# EAGLE design hotswap (EAGLE 9.3.0)
TEAM: IGVC
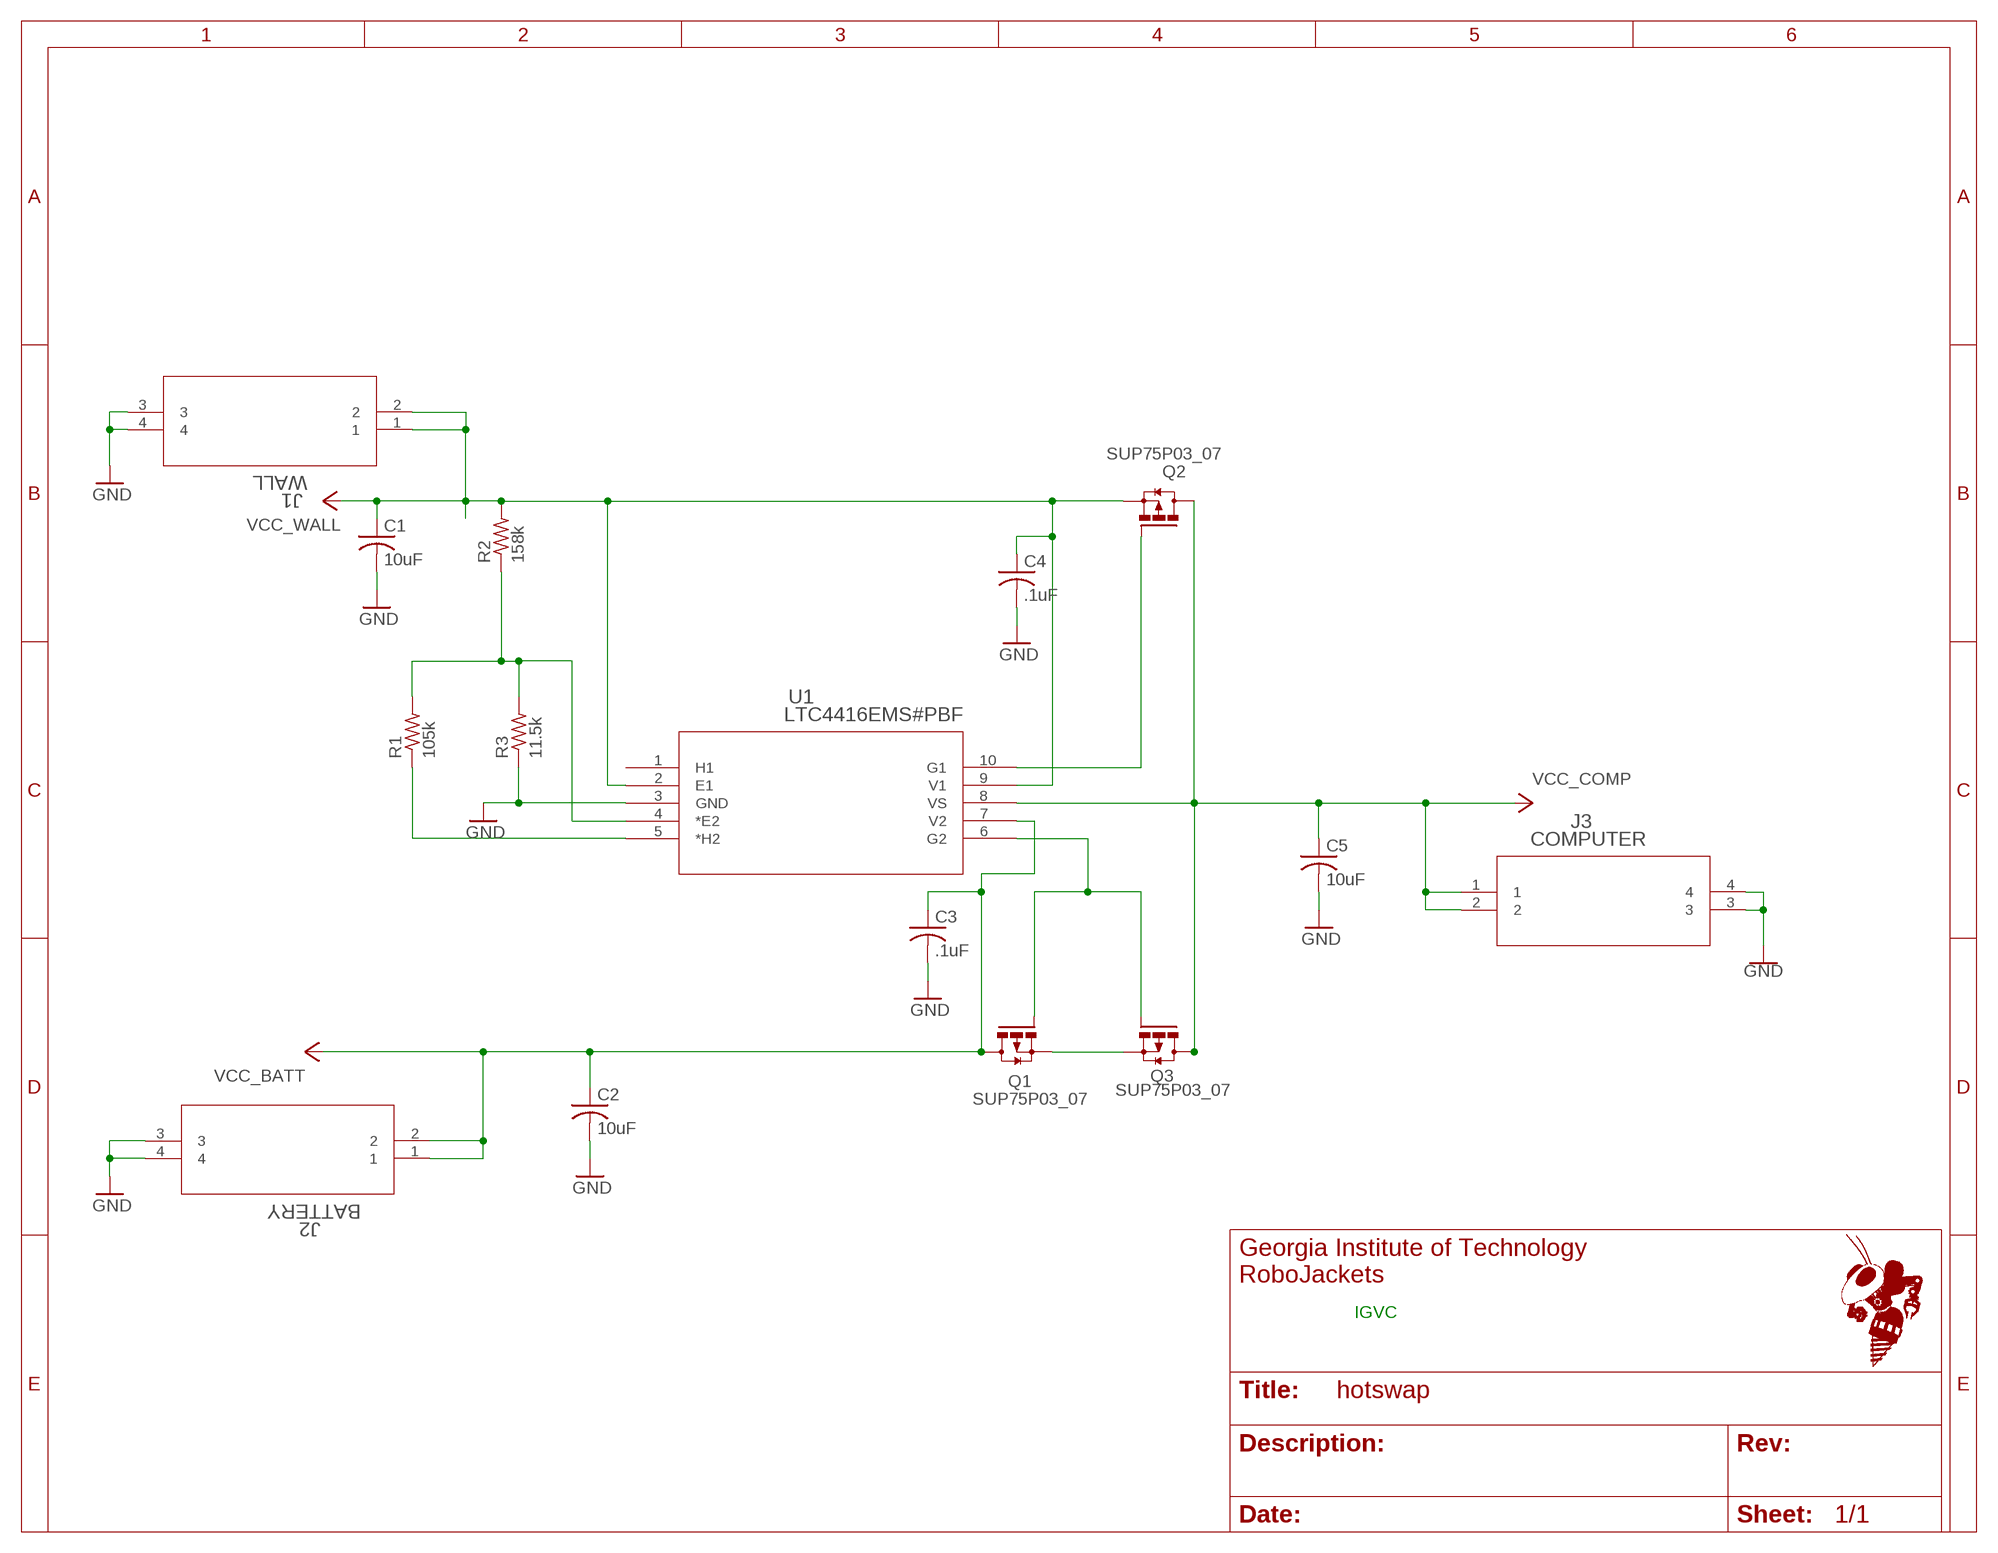
[diagram p0: schematic, sheet 1]

## Parts
C1  10uF  C-USC1210  [C1210]
C2  10uF  C-USC1210  [C1210]
C3  .1uF  C-USC0805  [C0805]
C4  .1uF  C-USC0805  [C0805]
C5  10uF  C-USC1210  [C1210]
J1  WALL  641737-1  [641737-1]
J2  BATTERY  641737-1  [641737-1]
J3  COMPUTER  641737-1  [641737-1]
Q1  SUP75P03_07  [DPACK_2]
Q2  SUP75P03_07  [DPACK_2]
Q3  SUP75P03_07  [DPACK_2]
R1  105k  R-US_R0603  [R0603]
R2  158k  R-US_R0603  [R0603]
R3  11.5k  R-US_R0603  [R0603]
U1  LTC4416EMS#PBF  [MSOP-10_MS]

## Nets
GND: C1.2 C2.2 C3.2 C4.2 C5.2 J1.3 J1.4 J2.3 J2.4 J3.3 J3.4 R3.1 U1.3(GND)
N$1: Q1.S Q3.S
N$3: Q1.G Q3.G U1.6(G2)
N$4: Q2.G U1.10(G1)
N$5: R1.2 R2.1 R3.2 U1.4(*E2)
N$9: R1.1 U1.5(*H2)
VCC_BATT: C2.1 C3.1 J2.1 J2.2 Q1.D U1.7(V2)
VCC_COMP: C5.1 J3.1 J3.2 Q2.D Q3.D U1.8(VS)
VCC_WALL: C1.1 C4.1 J1.1 J1.2 Q2.S R2.2 U1.2(E1) U1.9(V1)
Unconnected: U1.1(H1)

## Notes on the sheet
- IGVC

## Library data of the parts
C1-C5 = rcl:C-US: CAPACITOR, American symbol; SPICEPREFIX: C
J1-J3 = IGVC-Connector:641737-1; MANUFACTURER_PART_NUMBER: 6417371; VENDOR: TE Connectivity
Q1-Q3 = IGVC-Discrete:SUP75P03_07
R1-R3 = rcl:R-US_: RESISTOR, American symbol; SPICEPREFIX: R
U1 = IGVC-Discrete:LTC4416EMS#PBF; DESCRIPTION: LTC4416/LTC4416-1 - 36V, Low Loss Dual PowerPath Controllers for Large PFETs; DIGI-KEY_PART_NUMBER: LTC4416EMS#PBF-ND; DIGI-KEY_PURCHASE_URL: https://www.digikey.com/product-detail/en/linear-technology-analog-devices/LTC4416EMS-PBF/LTC4416EMS-PBF-ND/1620181?utm_source=snapeda&utm_medium=aggregator&utm_campaign=symbol; MF: Linear Technology; MP: LTC4416EMS#PBF; PACKAGE: MSOP-10 Linear Technology

## Board
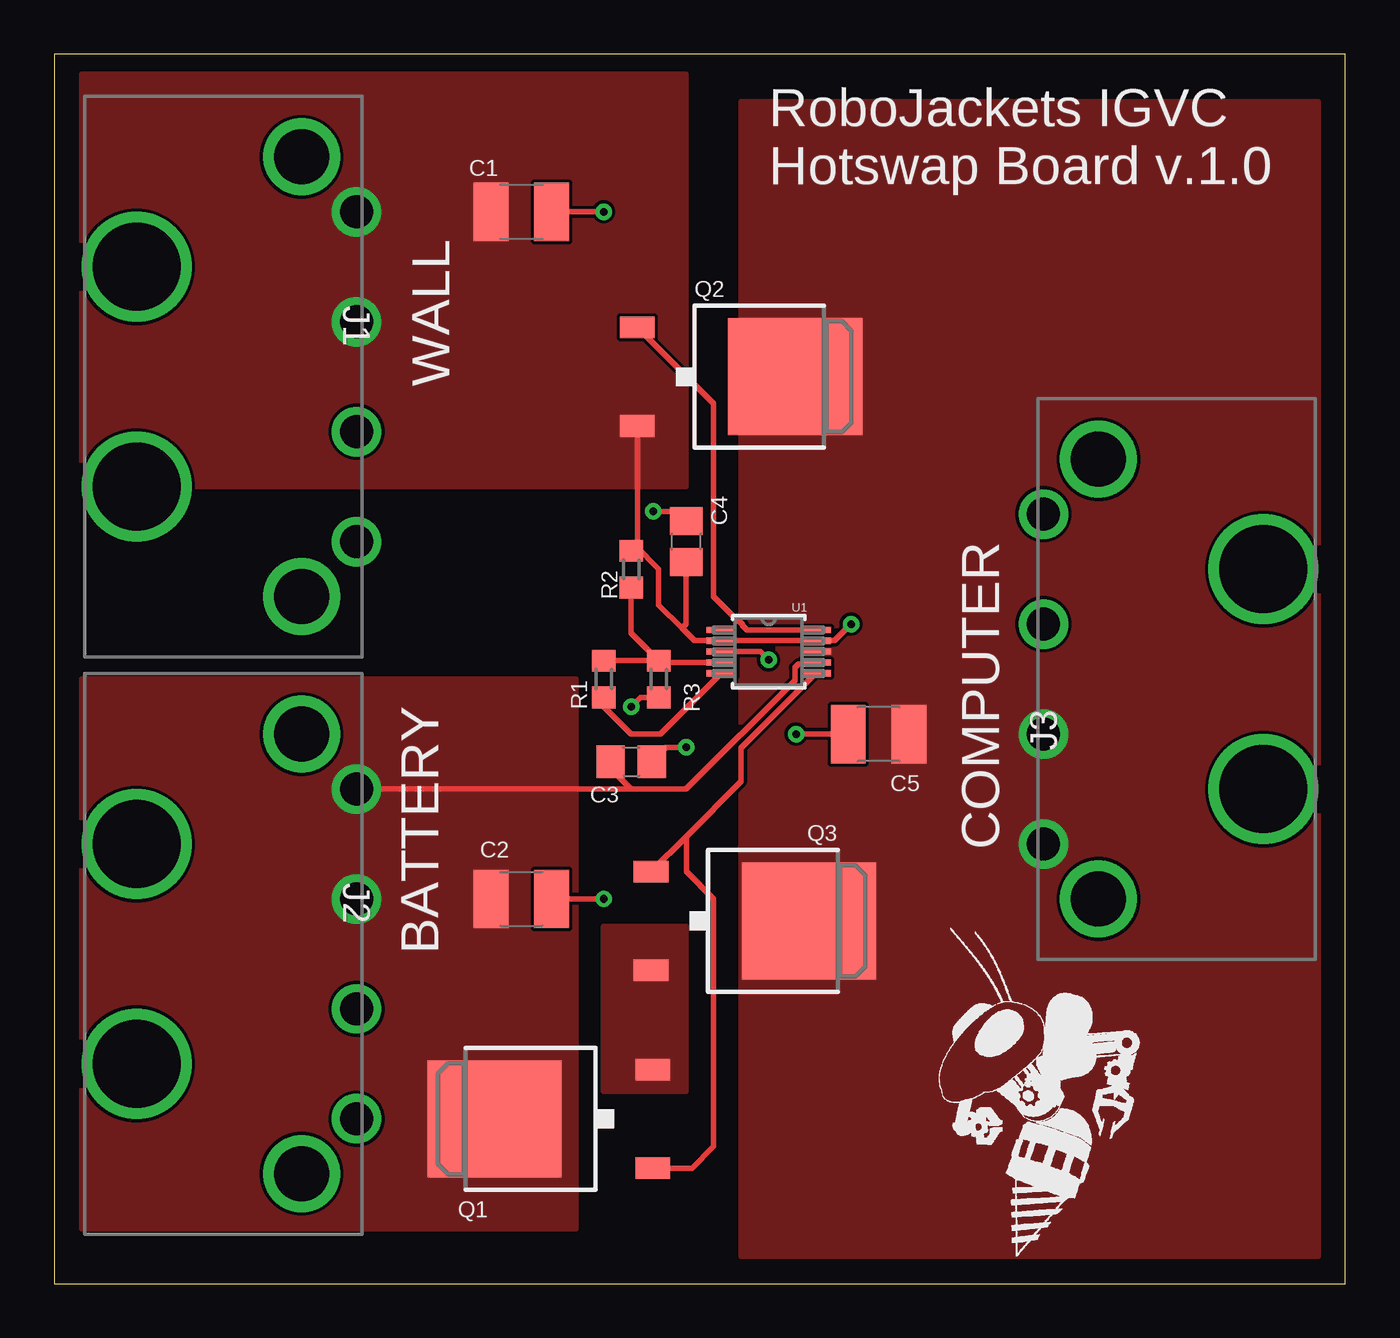
[diagram p1: board, top side]
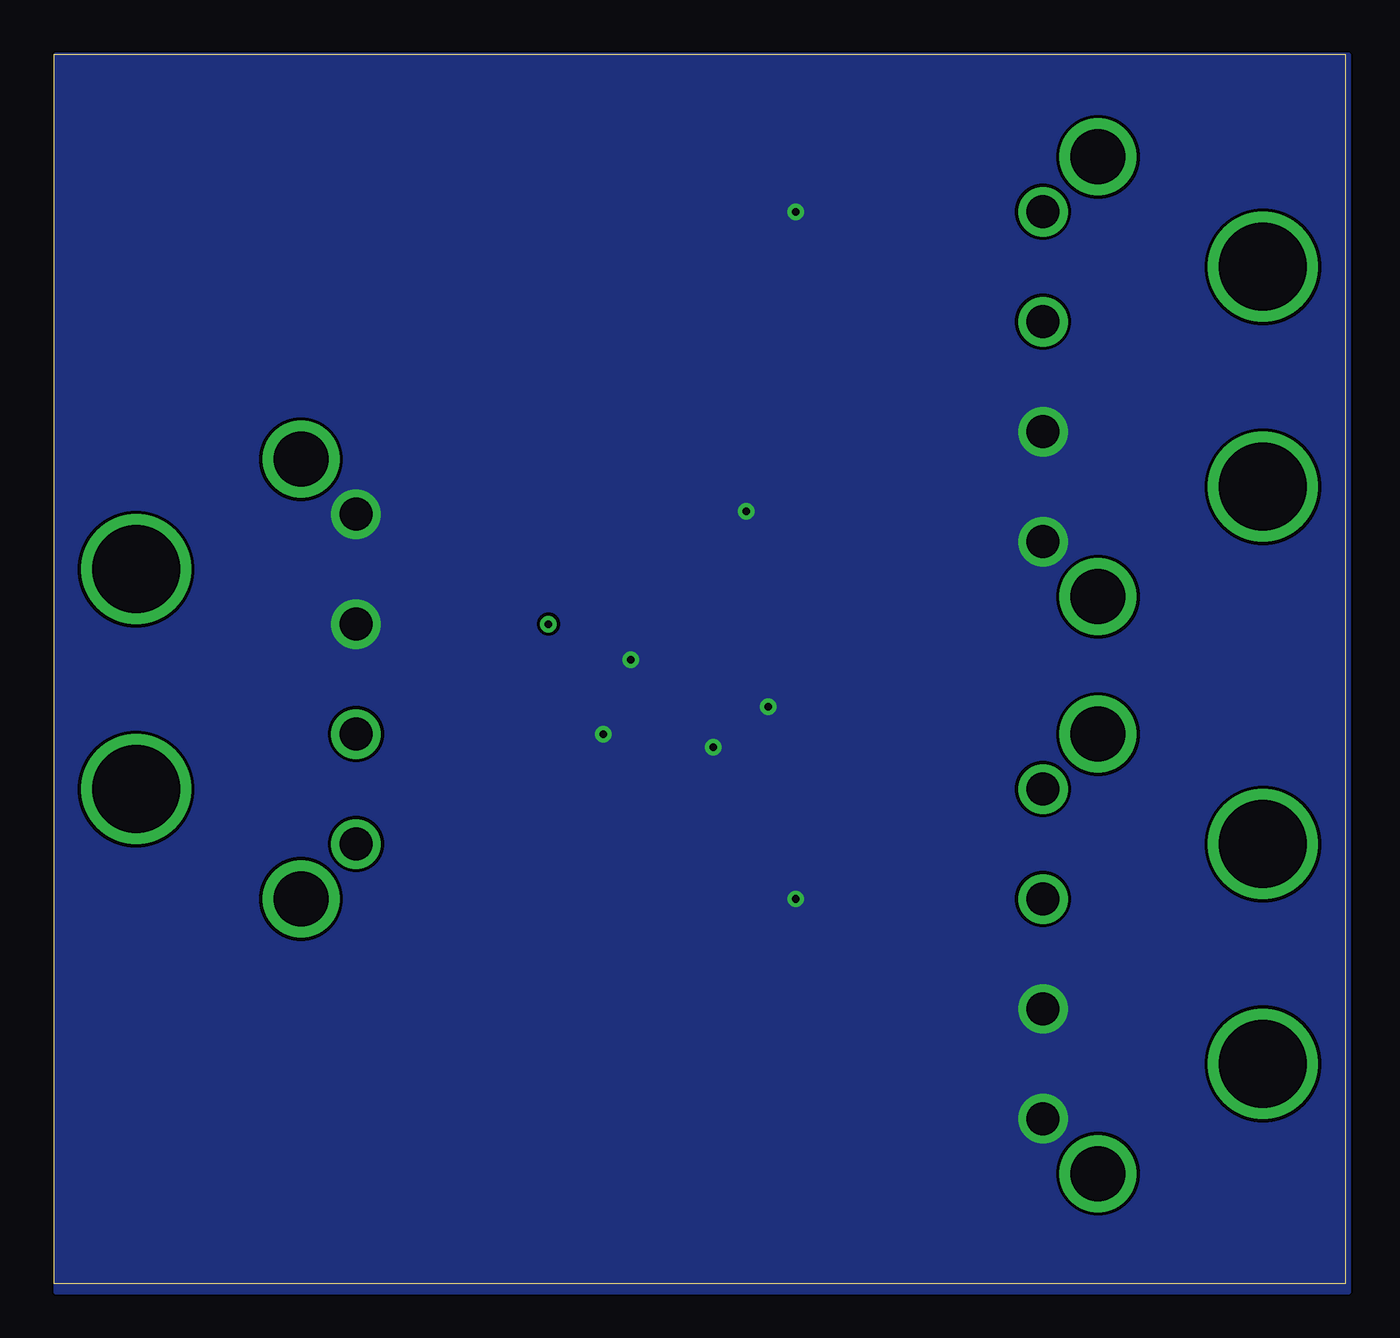
[diagram p2: board, bottom side, seen from below]

Size 59.67 x 56.82 mm. Coordinates in mm from the lower left corner, seen from the top.
Outline: 0,0 59.67,0 59.67,56.82 0,56.82 0,0
Copper layers (1*16): Top 0.0356mm / dielectric 63mil / Bottom 0.0356mm
Design rules "RJ2LayerDRU *": minimum track width 6mil, minimum drill 15mil, track to track 6mil, track to pad 6mil, pad to pad 6mil, via to via 6mil, smd to smd 6mil, copper to edge 0mil, drill to drill 6mil, minimum pad ring 10mil, minimum via ring 8mil, stop-mask expansion 4mil, vias tented up to drill 0mil, thermal gap 10mil

### Footprints (pad centres in the part's own frame; a part is rotated, then mirrored left to right if it is on the bottom)
C1210 = smd 1.6 x 2.7: 1 -1.4,0; 2 1.4,0
C0805 = smd 1.3 x 1.5: 1 -0.95,0; 2 0.95,0
641737-1 = drill 1.524 pad 2.286: 1 -15.24,0; 2 -10.16,0; 3 -5.08,0; 4 0,0 | drill 2.54 pad 2.794: 5 -17.78,-2.54; 6 2.54,-2.54 | drill 4.064 pad 4.572: 7 -12.7,-10.16; 8 -2.54,-10.16
DPACK_2 = smd 5.4 x 6.2: D 0,2.5 | smd 1 x 1.6: G -2.28,-4.8; S 2.28,-4.8
R0603 = smd 1 x 1.1: 1 -0.85,0; 2 0.85,0
MSOP-10_MS = smd 1.397 x 0.279: 1 -2.184,1.001; 2 -2.184,0.5; 3 -2.184,0; 4 -2.184,-0.5; 5 -2.184,-1.001; 6 2.184,-1.001; 7 2.184,-0.5; 8 2.184,0; 9 2.184,0.5; 10 2.184,1.001

### Placement (x,y rotation side)
C1  21.59,49.53 0 top
C2  21.59,17.78 0 top
C3  26.67,24.13 0 top
C4  29.21,34.29 90 top
C5  38.1,25.4 180 top
E$1  [ROBOBUZZ_0.8X]  44.45,1.27 0 top
J1  13.97,34.29 270 top
J2  13.97,7.62 270 top
J3  45.72,35.56 90 top
Q1  22.86,7.62 90 top
Q2  31.75,41.91 270 top
Q3  32.38,16.76 270 top
R1  25.4,27.94 90 top
R2  26.67,33.02 90 top
R3  27.94,27.94 90 top
U1  33.02,29.21 0 top

### Tracks (layer width: path | path; a pad name or v marks a point on that pad's centre or on a via)
GND  (via drill 0.35)
  Top 0.254: R3.1 27.09,27.09 v26.67,26.67 | v33.02,28.83 32.64,29.21 U1.3 | C5.2 v34.29,25.4 | v29.21,24.79 28.28,24.79 C3.2 | v25.4,17.78 C2.2 | C1.2 v25.4,49.53 | C4.2 28.76,35.69 v27.69,35.69
  pour Bottom (no thermals): -0.13,56.77 59.56,56.77 59.56,-0.38 -0.13,-0.38
N$1
  pour Top (no thermals): 25.4,16.51 25.4,8.89 29.21,8.89 29.21,16.51
N$3
  Top 0.254: U1.6 31.75,24.75 31.75,23.21 29.22,20.68 | Q1.G 29.47,5.34 30.48,6.35 30.48,17.78 29.22,19.04 29.22,20.68 | Q3.G 29.22,20.68
N$4
  Top 0.254: Q2.G 30.48,40.66 30.48,31.75 31.6,30.63 31.65,30.63 31.81,30.47 31.81,30.42 32.02,30.21 U1.10
N$5
  Top 0.254: U1.4 28.02,28.71 R3.2 | R3.2 R1.2 | R3.2 26.67,30.06 R2.1
N$9
  Top 0.254: U1.5 28.03,25.4 26.67,25.4 25.4,26.67 R1.1
VCC_BATT
  Top 0.254: U1.7 35.12,28.63 34.39,28.63 34.23,28.46 34.23,27.88 29.21,22.86 26.67,22.86 | 26.67,22.86 J2.1 | C3.1 25.72,23.81 26.67,22.86
  pour Top (no thermals): 1.27,27.94 24.13,27.94 24.13,2.54 1.27,2.54
VCC_COMP
  pour Top (no thermals): 58.42,54.61 58.42,1.27 31.75,1.27 31.75,54.61
VCC_WALL  (via drill 0.35)
  Top 0.254: R2.2 26.88,34.08 | 26.88,34.08 26.95,34.15 Q2.S | v36.83,30.48 36.06,29.71 U1.9 U1.2 29.6,29.71 29.02,30.29 | 26.88,34.08 27.94,33.02 27.94,31.37 29.02,30.29 | 29.02,30.29 29.21,30.48 C4.1
  pour Top (no thermals): 1.27,55.88 29.21,55.88 29.21,36.83 1.27,36.83 1.27,40.64

### Text on the board
tNames: RoboJackets IGVC / Hotswap Board v.1.0 | WALL | COMPUTER | BATTERY